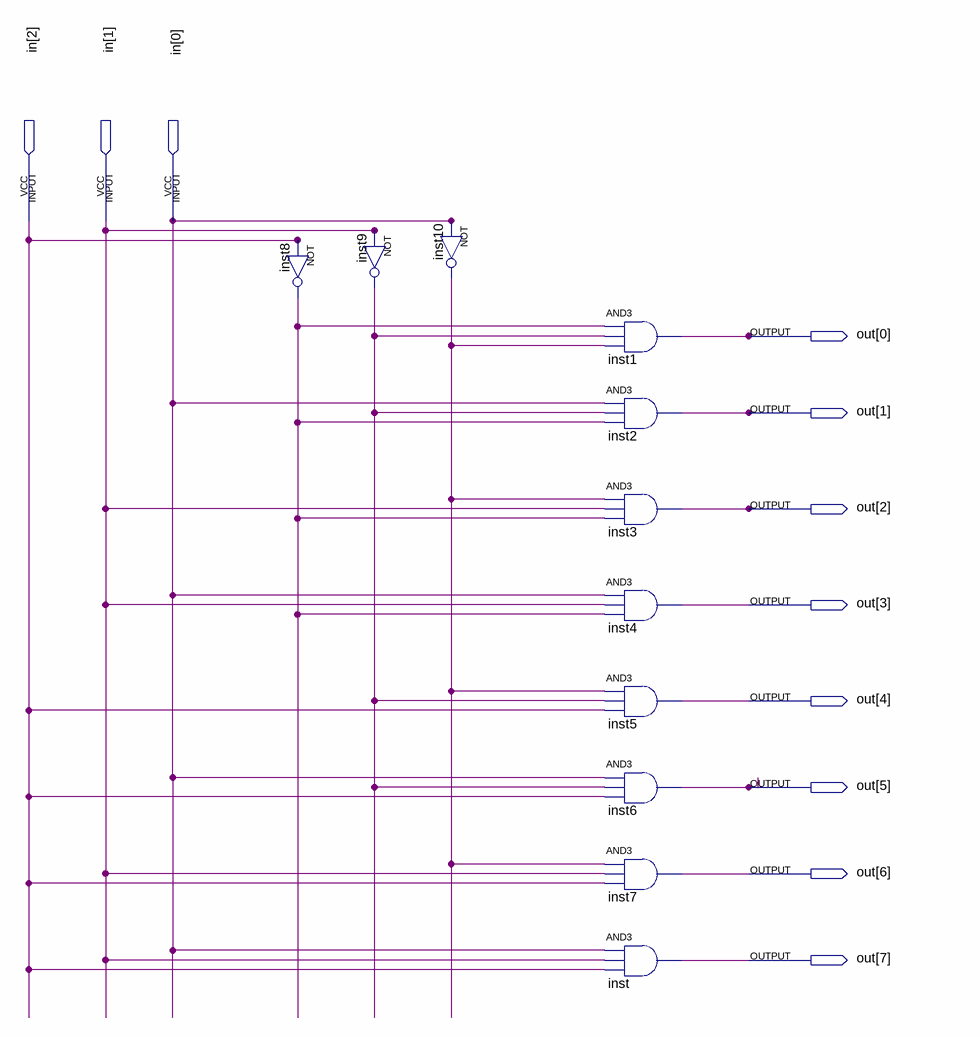
[diagram p0: schematic sheet]
// Quartus schematic decoder_3_8.bdf as structural Verilog: 11 symbols, 11 pins
module decoder_3_8 (
  input  [2:0] in,
  output [7:0] out
);

  wire inst8_out, inst9_out, inst10_out;

  not inst8 (inst8_out, in[2]);
  not inst9 (inst9_out, in[1]);
  not inst10 (inst10_out, in[0]);
  and inst1 (out[0], inst8_out, inst9_out, inst10_out);
  and inst2 (out[1], in[0], inst9_out, inst8_out);
  and inst3 (out[2], inst10_out, in[1], inst8_out);
  and inst4 (out[3], in[0], in[1], inst8_out);
  and inst5 (out[4], inst10_out, inst9_out, in[2]);
  and inst6 (out[5], in[0], inst9_out, in[2]);
  and inst7 (out[6], inst10_out, in[1], in[2]);
  and inst (out[7], in[0], in[1], in[2]);
endmodule
